# Altium schematic sheet 100046138_output_control.SchDoc
size 863 x 558 mm; SheetNumber: 3; SheetTotal: 4
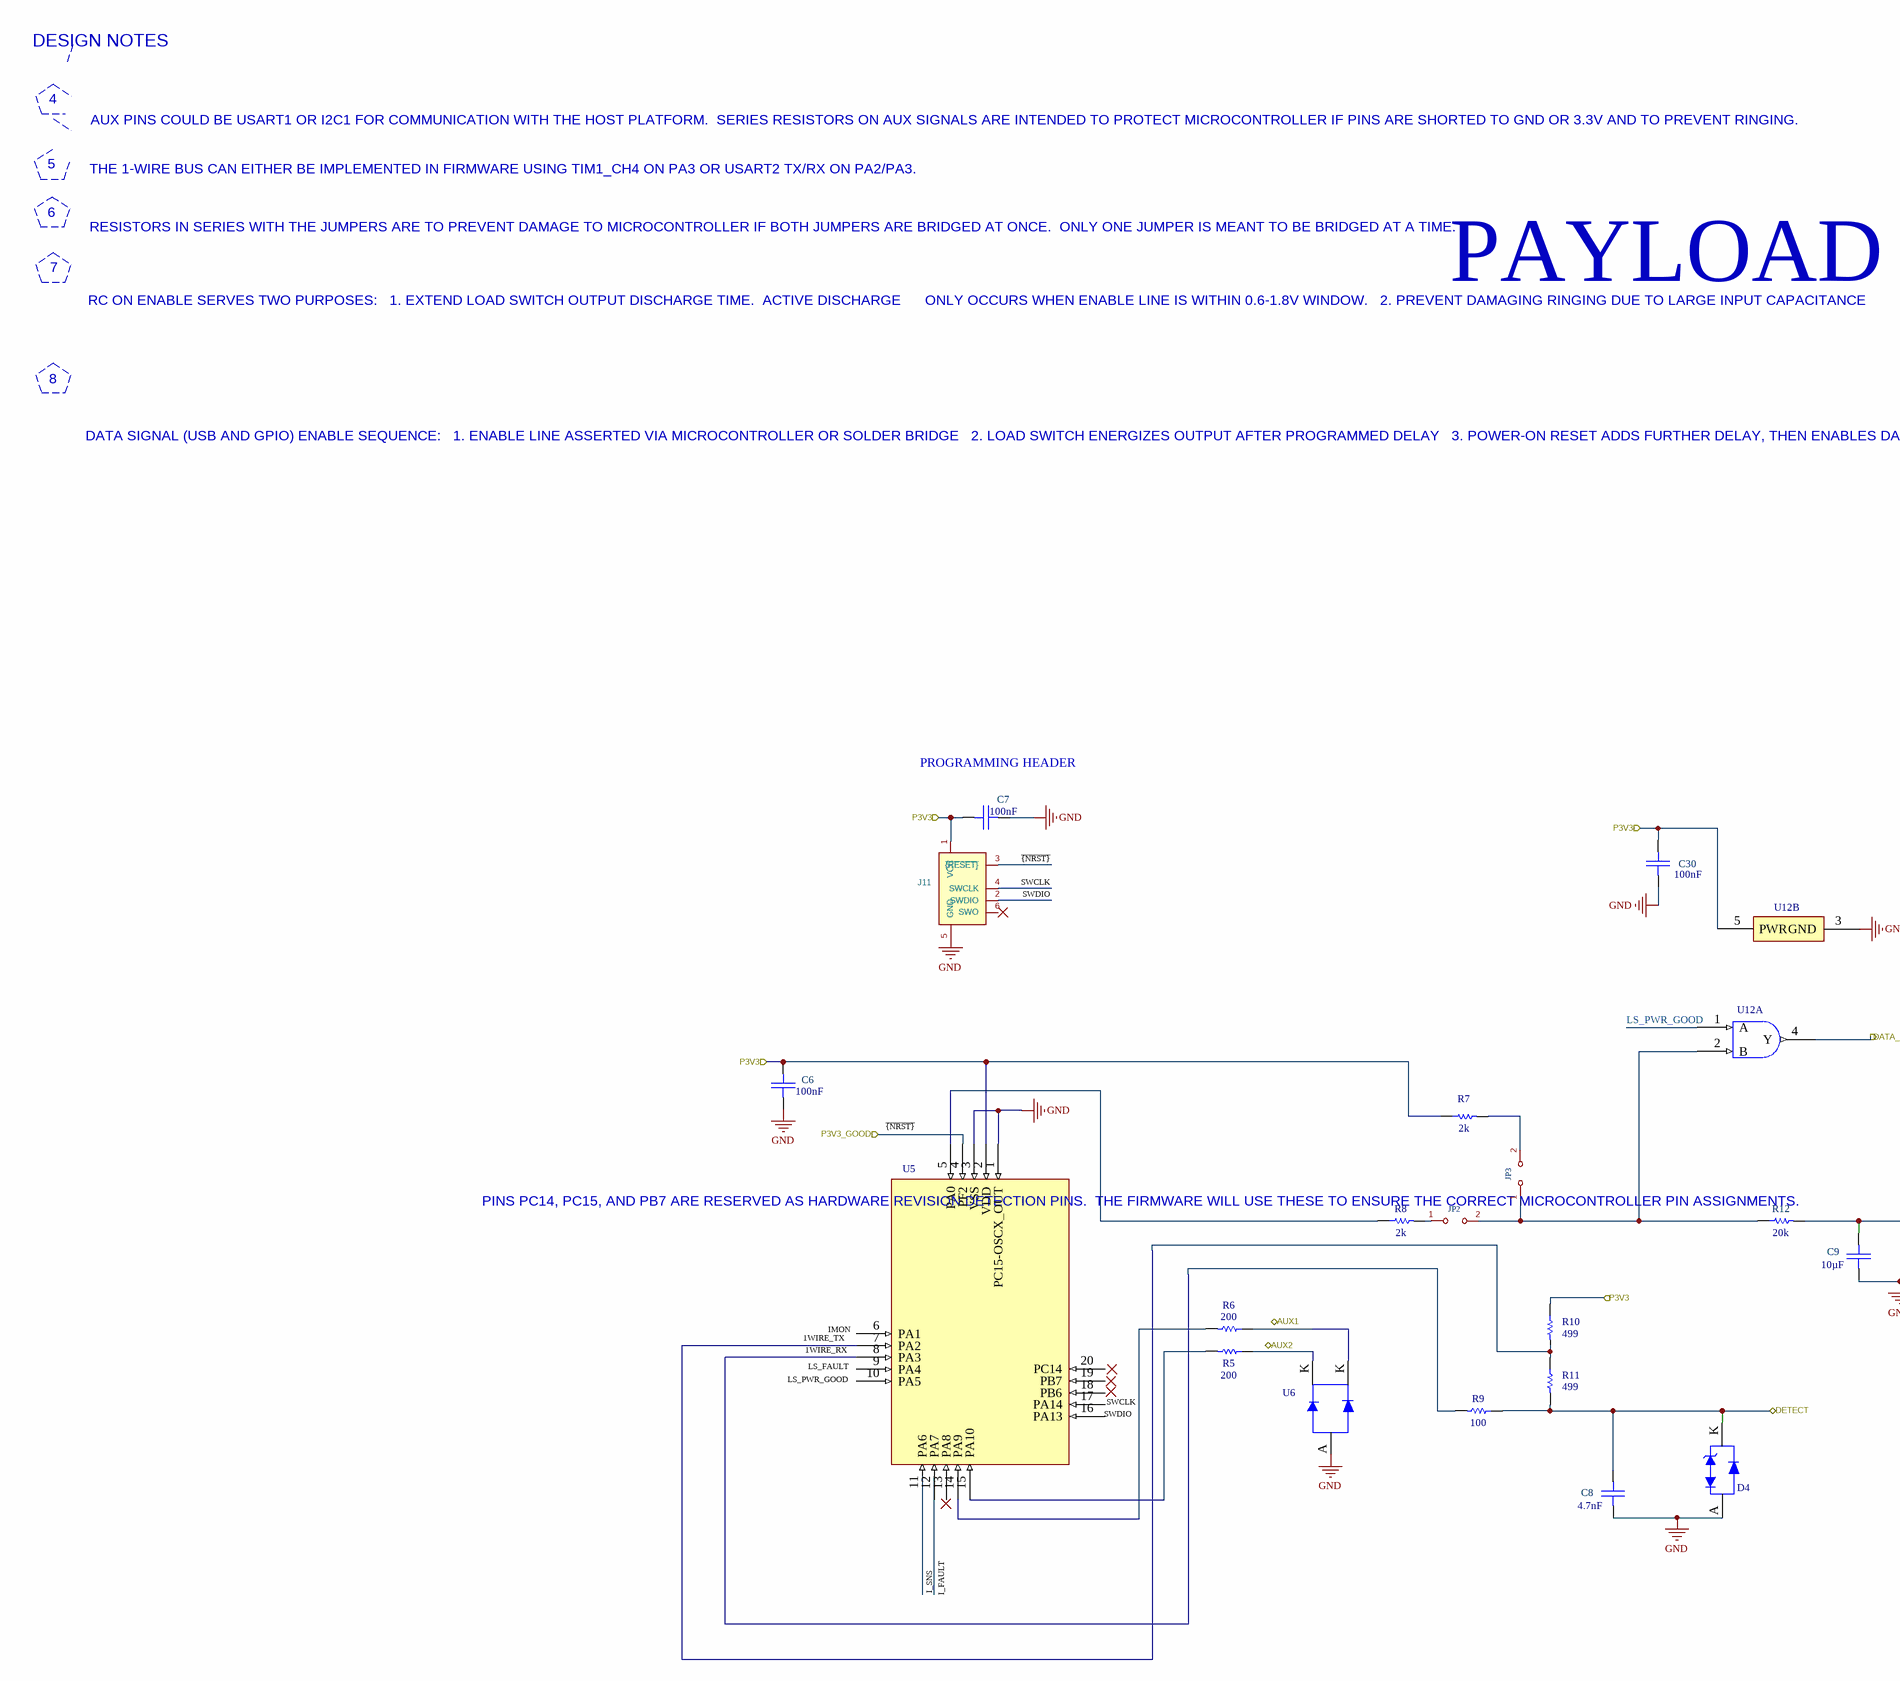
[diagram p0: 100046138_output_control.SchDoc, left]
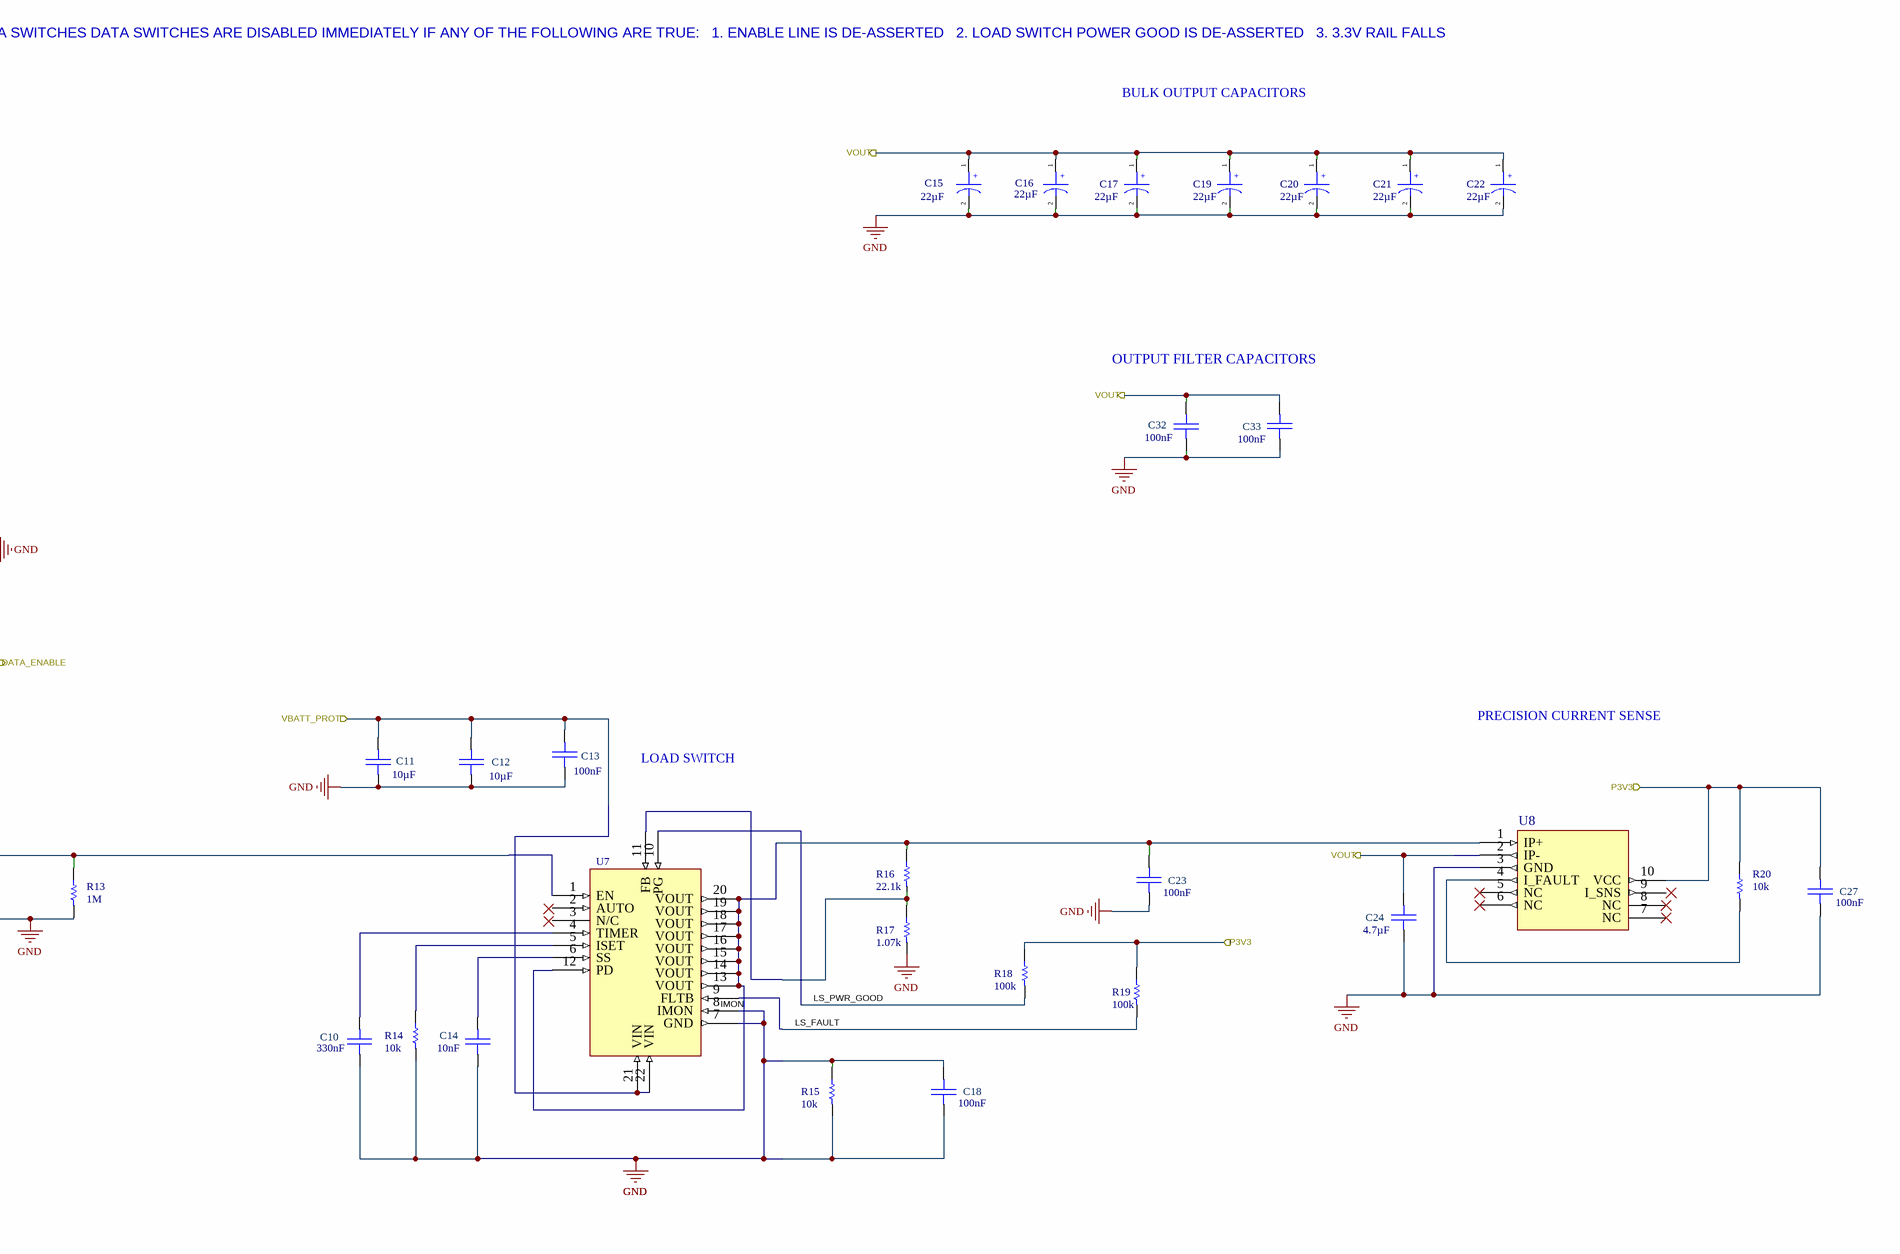
[diagram p1: 100046138_output_control.SchDoc, right]

## Parts
C6  value 100nF  [CAP-0402-A]  (hidden comment: Cap 0402 100nF 10% X7R)
C7  value 100nF  [CAP-0402-A]  (hidden comment: Cap 0402 100nF 10% X7R)
C8  value 4.7nF  [CAP-0402-A]  (hidden comment: CAP 0402 4700PF 50V 10% X7R)
C9  value 10µF  [CAP-0402-A]  (hidden comment: Cap 0402 10uF 10V 20% X5R)
C10  value 330nF  [CAP-0402-A]  (hidden comment: Cap 0402 0.33uF 16V 10% X7S)
C11  value 10µF  [CAP-0805-A]  (hidden comment: CAP 0805 10UF 50V 10% X5R)
C12  value 10µF  [CAP-0805-A]  (hidden comment: CAP 0805 10UF 50V 10% X5R)
C13  value 100nF  [CAP-0402-A]  (hidden comment: Cap 0402 100nF 10% X7R)
C14  value 10nF  [CAP-0402-A]  (hidden comment: Cap 0402 10000pf 50V 10% X7R)
C15  value 22µF  [CAP-0805-A]  (hidden comment: CAP 0805 22uF 35V 20% X5R)
C16  value 22µF  [CAP-0805-A]  (hidden comment: CAP 0805 22uF 35V 20% X5R)
C17  value 22µF  [CAP-0805-A]  (hidden comment: CAP 0805 22uF 35V 20% X5R)
C18  value 100nF  [CAP-0402-A]  (hidden comment: Cap 0402 100nF 10% X7R)
C19  value 22µF  [CAP-0805-A]  (hidden comment: CAP 0805 22uF 35V 20% X5R)
C20  value 22µF  [CAP-0805-A]  (hidden comment: CAP 0805 22uF 35V 20% X5R)
C21  value 22µF  [CAP-0805-A]  (hidden comment: CAP 0805 22uF 35V 20% X5R)
C22  value 22µF  [CAP-0805-A]  (hidden comment: CAP 0805 22uF 35V 20% X5R)
C23  value 100nF  [CAP-0402-A]  (hidden comment: Cap 0402 100nF 10% X7R)
C24  value 4.7µF  [CAP-0805-A]  (hidden comment: CAP 0805 4.7UF 50V 10% X7R)
C27  value 100nF  [CAP-0402-A]  (hidden comment: Cap 0402 100nF 10% X7R)
C30  value 100nF  [CAP-0402-A]  (hidden comment: Cap 0402 100nF 10% X7R)
C32  value 100nF  [CAP-0402-A]  (hidden comment: Cap 0402 100nF 10% X7R)
C33  value 100nF  [CAP-0402-A]  (hidden comment: Cap 0402 100nF 10% X7R)
D4  SMF3.3  [DI-SOD123F-A]  (value not drawn)
J11  Conn_ARM_SWD_TagConnect_TC2030-NL  [Tag-Connect_TC2030-IDC-NL_2x03_P1.27mm_Vertical]  (value not drawn)
JP2  Jumper_2_Bridged  [SolderJumper-2_P1.3mm_Open_TrianglePad1.0x1.5mm]  (value not drawn)
JP3  Jumper_2_Open  [SolderJumper-2_P1.3mm_Open_TrianglePad1.0x1.5mm]  (value not drawn)
R5  value 200  [RES-0402-A]  (hidden comment: RES 0402 200 OHM 1/10W 1%)
R6  value 200  [RES-0402-A]  (hidden comment: RES 0402 200 OHM 1/10W 1%)
R7  value 2k  [RES-0402-B]  (hidden comment: Res 0402 2K Ohm 1/10W 1% Thick Flim)
R8  value 2k  [RES-0402-B]  (hidden comment: Res 0402 2K Ohm 1/10W 1% Thick Flim)
R9  value 100  [RES-0402-B]  (hidden comment: Res 0402 100 Ohm 0.1W 1% Thick Film)
R10  value 499  [RES-0402-A]  (hidden comment: RES 0402 499 OHM 1/10W 1%)
R11  value 499  [RES-0402-A]  (hidden comment: RES 0402 499 OHM 1/10W 1%)
R12  value 20k  [RES-0402-A]  (hidden comment: Res 0402 20k 1/16W 1% Thick Film)
R13  value 1M  [RES-0402-C]  (hidden comment: Res 0402 1.00M 0.1W 1% Thick Film)
R14  value 10k  [RES-0402-A]  (hidden comment: RES 0402 10K 1/10W 1%)
R15  value 10k  [RES-0402-A]  (hidden comment: RES 0402 10K 1/10W 1%)
R16  value 22.1k  [RES-0402-A]  (hidden comment: RES 0402 22.1K 1/10W 1%)
R17  value 1.07k  [RES-0402-A]  (hidden comment: RES 0402 1.07K 1/10W 1%)
R18  value 100k  [RES-0402-C]  (hidden comment: Res 0402 100K 1/10W 1% Thick Flim)
R19  value 100k  [RES-0402-C]  (hidden comment: Res 0402 100K 1/10W 1% Thick Flim)
R20  value 10k  [RES-0402-A]  (hidden comment: RES 0402 10K 1/10W 1%)
U5  STM32C011F6U6TR  [IC-UFQFPN20-A]  (value not drawn)
U6  PESD5V0C2UM  [IC-SOT883-2-B]  (value not drawn)
U7  MPQ5069GQV-AEC1-Z  [IC-QFN22-3X5-A]  (value not drawn)
U8  ACS711KEXLT-15AB-T  [QFN127P600-8N]  (value not drawn)
U12  Gate - AND  [IC-SOT553-A]  (value not drawn)  (parts A,B of 2)

## Ports
AUX1 (bidir), AUX2 (bidir), DATA_ENABLE (out), DETECT (bidir), P3V3 (in), P3V3_GOOD (in), VBATT_PROT (in), VOUT (out)

## Nets
GND: C6.1 C7.2 C8.1 C9.1 C10.1 C11.1 C12.1 C13.1 C14.1 C15.2 C16.2 C17.2 C18.1 C18.2 C19.2 C20.2 C21.2 C22.2 C23.1 C24.1 C27.2 C30.1 C32.2 C33.1 D4.A J11.5(GND) R13.1 R14.1 R15.1 R15.2 R17.1 U5.1(PC15-OSCX_OUT) U5.3(VSS) U7.7(GND) U7.8(IMON) U8.3(GND) U12.3(GND)
DATA_ENABLE: U12.4(Y) ; port DATA_ENABLE
DETECT: C8.2 D4.K R9.2 R11.1 ; port DETECT
LS_FAULT: R19.1 U7.9(FLTB)
LS_PWR_GOOD: R18.1 U7.10(PG) U12.1(A)
P3V3: C6.2 C7.1 C27.1 C30.2 J11.1(VCC) R7.2 R10.2 R18.2 R19.2 R20.2 U5.2(VDD) U8.10(VCC) U12.5(PWR) ; port P3V3
P3V3_GOOD: U5.4(PF2) ; port P3V3_GOOD
SWCLK: J11.4(SWCLK)
SWDIO: J11.2(SWDIO)
VBATT_PROT: C11.2 C12.2 C13.2 U7.21(VIN) U7.22(VIN) ; port VBATT_PROT
VOUT: C15.1 C16.1 C17.1 C19.1 C20.1 C21.1 C22.1 C24.2 C32.1 C33.2 U8.2(IP-) ; port VOUT
~{{NRST}}: J11.3(~{{RESET}})
NetC9_2: C9.2 R12.1 R13.2 U7.1(EN)
NetC10_2: C10.2 U7.4(TIMER)
NetC14_2: C14.2 U7.6(SS)
NetC23_2: C23.2 R16.2 U7.12(PD) U7.13(VOUT) U7.14(VOUT) U7.15(VOUT) U7.16(VOUT) U7.17(VOUT) U7.18(VOUT) U7.19(VOUT) U7.20(VOUT) U8.1(IP+)
NetJP2_1: JP2.1(A) R8.1
NetJP2_2: JP2.2(B) JP3.1(A) R12.2 U12.2(B)
NetJP3_2: JP3.2(B) R7.1
NetR5_1: R5.1 U5.15(PA10)
NetR5_2: R5.2 U6.K
NetR6_1: R6.1 U5.14(PA9)
NetR6_2: R6.2 U6.K
NetR8_2: R8.2 U5.5(PA0)
NetR9_1: R9.1 U5.8(PA3)
NetR10_1: R10.1 R11.2 U5.7(PA2)
NetR14_2: R14.2 U7.5(ISET)
NetR16_1: R16.1 R17.2 U7.11(FB)
NetR20_1: R20.1 U8.4(I_FAULT)

Not connected (* = marked no-connect by the designer): J11 6(SWO); U5 6(PA1) 9(PA4) 10(PA5) 11(PA6) 12(PA7) 13(PA8) 16(PA13) 17(PA14) 18(PB6) 19(PB7) 20(PC14); U6 A; U7 2(AUTO) 3(N/C); U8 5(NC)* 6(NC)* 7(NC)* 8(NC)* 9(I_SNS)

## Notes on the sheet
- DESIGN NOTES
- 4
- AUX PINS COULD BE USART1 OR I2C1 FOR COMMUNICATION
  WITH THE HOST PLATFORM.  SERIES RESISTORS ON AUX SIGNALS
  ARE INTENDED TO PROTECT MICROCONTROLLER IF PINS ARE
  SHORTED TO GND OR 3.3V AND TO PREVENT RINGING.
- 5
- THE 1-WIRE BUS CAN EITHER BE IMPLEMENTED IN FIRMWARE
  USING TIM1_CH4 ON PA3 OR USART2 TX/RX ON PA2/PA3.
- 6
- 7
- RESISTORS IN SERIES WITH THE JUMPERS ARE TO PREVENT
  DAMAGE TO MICROCONTROLLER IF BOTH JUMPERS ARE BRIDGED
  AT ONCE.  ONLY ONE JUMPER IS MEANT TO BE BRIDGED AT A TIME.
- RC ON ENABLE SERVES TWO PURPOSES:
  1. EXTEND LOAD SWITCH OUTPUT DISCHARGE TIME.  ACTIVE DISCHARGE
  ONLY OCCURS WHEN ENABLE LINE IS WITHIN 0.6-1.8V WINDOW.
  2. PREVENT DAMAGING RINGING DUE TO LARGE INPUT CAPACITANCE
- PAYLOAD POWER CONTROL
- 8
- DATA SIGNAL (USB AND GPIO) ENABLE SEQUENCE:
  1. ENABLE LINE ASSERTED VIA MICROCONTROLLER OR SOLDER BRIDGE
  2. LOAD SWITCH ENERGIZES OUTPUT AFTER PROGRAMMED DELAY
  3. POWER-ON RESET ADDS FURTHER DELAY, THEN ENABLES DATA SWITCHES
  DATA SWITCHES ARE DISABLED IMMEDIATELY IF ANY OF THE FOLLOWING ARE TRUE:
  1. ENABLE LINE IS DE-ASSERTED
  2. LOAD SWITCH POWER GOOD IS DE-ASSERTED
  3. 3.3V RAIL FALLS BELOW POWER-ON RESET THRESHOLD
- BULK OUTPUT CAPACITORS
- (near C7) PROGRAMMING HEADER
- OUTPUT FILTER CAPACITORS
- PRECISION CURRENT SENSE
- LOAD SWITCH
- (near U5) PINS PC14, PC15, AND PB7 ARE
  RESERVED AS HARDWARE REVISION
  DETECTION PINS.  THE FIRMWARE
  WILL USE THESE TO ENSURE THE
  CORRECT MICROCONTROLLER PIN
  ASSIGNMENTS.
- Labels drawn without touching a wire or pin: 1WIRE_RX, 1WIRE_TX, GND, I_FAULT, I_SNS, IMON, LS_FAULT, LS_PWR_GOOD, SWCLK, SWDIO, ~{{NRST}}
- DWG NO
- REVISIONS
- SH
- REVISION
- DESCRIPTION
- DATE(YEAR-MO-DA)
- APPROVED
- PART NO.
- DESIGN ACTIVITY
- US ARMY
  COMBAT CAPABILITIES DEVELOPMENT COMMAND ARMAMENTS CENTER
  PICATINNY ARSENAL, NEW JERSEY 07806-5000
- SIZE
- CAGE CODE
- DWG NO.
- D
- 19200
- SCALE
- NONE
- UNIT WT.
- ---
- SHEET
- (in symbol CAP-00375-1) +

## Library data of the parts
C6 C7 C13 C18 C23 C27 C30 C32 C33 = CAP-00363-2: Leader Qty: 100; UOM: EA; Voltage Rating: 50V; Footprint: Capacitor_SMD:C_0402_1005Metric; Case/Package: 0402; Max Operating Temperature: 125°C; Min Operating Temperature: -55°C; Mounting Technology: Surface Mount; Tolerance: 10%
C8 = CAP-00371-1: Leader Qty: 100; UOM: EA; Footprint: Capacitor_SMD:C_0402_1005Metric; Case/Package: 0402; Max Operating Temperature: 150°C; Min Operating Temperature: -55°C; Mounting Technology: Surface Mount; Tolerance: 10%
C9 = CAP-00021-6: Capacitor Type: Ceramic; Leader Qty: 100; Footprint: Capacitor_SMD:C_0402_1005Metric; Case/Package: 0402; Max Operating Temperature: 85°C; Min Operating Temperature: -55°C; Mounting Technology: SMT; Pins: 2; RoHS Compliant: Yes; Tolerance: 20%; Voltage Rating: 10V
C10 = CAP-00366-2: Leader Qty: 100; UOM: EA; Footprint: Capacitor_SMD:C_0402_1005Metric; Case/Package: 0402; Max Operating Temperature: 125°C; Min Operating Temperature: -55°C; Mounting Technology: Surface Mount; Voltage Rating: 16V
C11 C12 = CAP-00370-1: Leader Qty: 100; UOM: EA; Footprint: Capacitor_SMD:C_0805_2012Metric; Case/Package: 0805; Dielectric: X5R; Max Operating Temperature: 85°C; Min Operating Temperature: -55°C; Mounting Technology: Surface Mount
C14 = CAP-00186-4: 0402 10 nF 50 V ±10 % Tolerance X7R SMT Multilayer Ceramic Capacitor; Leader Qty: 100; Footprint: Capacitor_SMD:C_0402_1005Metric; Case/Package: 0402; Case Code (Imperial): 0402; Max Operating Temperature: 125°C; Min Operating Temperature: -55°C; Mounting Technology: Surface Mount; RoHS Compliant: Yes; Tolerance: 10%; Voltage Rating: 50V
C15-C17 C19-C22 = CAP-00375-1: Leader Qty: 25; Footprint: Capacitor_SMD:C_0805_2012Metric; Case/Package: 0805; Max Operating Temperature: 85°C; Min Operating Temperature: -55°C; Mounting Technology: Surface Mount; Tolerance: 20%; Voltage Rating: 35V
C24 = CAP-00372-1: Leader Qty: 100; UOM: EA; Footprint: Capacitor_SMD:C_0805_2012Metric; Case/Package: 0805; Max Operating Temperature: 125°C; Min Operating Temperature: -55°C; Mounting Technology: Surface Mount; Voltage Rating: 50V
D4 = CMP-00658-1: ESD protection diodes / TVS diodes; LITTELFUSE; SMF3.3; 6.8 V; 30 A; 3.3 V; 3.4 V - 4.3 V; Breakdown Voltage: 3.85V; Clamping Voltage: 6.8V; Direction: Unidirectional; Forward Voltage: 16V; Max Breakdown Voltage: 4.3V; Max Junction Temperature (Tj): 150°C; Max Power Dissipation: 1.7W; Max Reverse Leakage Current: 500nA; Min Breakdown Voltage: 3.4V; Number of Channels: 1; Peak Pulse Current: 30A; Peak Pulse Power: 200W; Reverse Standoff Voltage: 3.3V; Test Current: 10mA; Footprint: 1a_Littelfuse:SOD-123FL; Country of Origin: Mainland China; Export Control Classification Number (ECCN) Code: EAR99; Harmonized Tariff Schedule (HTS) Code: 8541.10.00.50; Height: 1.08mm; Introduction Date: 2016-08-01; Lifecycle Status: Production; Max Operating Temperature: 150°C; Min Operating Temperature: -55°C; Number of Elements: 1; Number of Terminals: 2; Packaging: Cut Tape; Peak Reverse Current: 500nA; Polarity: Unidirectional; REACH SVHC: No; Reverse Voltage: 3.3V; RoHS: Compliant; Schedule B: 8541100080
J11 = Conn_ARM_SWD_TagConnect_TC2030-NL: Manufacturer: Tag-Connect LLC; MPN: TC2030-CTX; Value: Conn_ARM_SWD_TagConnect_TC2030-NL; Footprint: Connector:Tag-Connect_TC2030-IDC-NL_2x03_P1.27mm_Vertical
R5 R6 = RES-00801-1: Leader Qty: 100; UOM: EA; Voltage Rating: 50V; Footprint: Resistor_SMD:R_0402_1005Metric; Case/Package: 0402; Max Operating Temperature: 155°C; Min Operating Temperature: -55°C; Mounting Technology: Surface Mount; Tolerance: 1%
R7 R8 = RES-00296-6: Leader Qty: 100; Power: 100mW; Voltage Rating: 50V; Footprint: Resistor_SMD:R_0402_1005Metric; Case/Package: 0402; Max Operating Temperature: 155°C; Min Operating Temperature: -55°C; Mounting Technology: SMT; Pins: 2; RoHS Compliant: Yes; Tolerance: 1%
R9 = RES-00021-9: Power: 100mW; Voltage Rating: 100V; Footprint: Resistor_SMD:R_0402_1005Metric; Case/Package: 0402; Leader Qty: 100; Max Operating Temperature: 155°C; Min Operating Temperature: -55°C; Mounting Technology: SMD; Pins: 2; Tolerance: 1%
R10 R11 = RES-00802-1: Leader Qty: 100; UOM: EA; Voltage Rating: 50V; Footprint: Resistor_SMD:R_0402_1005Metric; Case/Package: 0402; Max Operating Temperature: 155°C; Min Operating Temperature: -55°C; Mounting Technology: Surface Mount; Tolerance: 1%
R12 = RES-00405-6: Leader Qty: 100; Max Power Dissipation: 63mW; Power Rating: 62.5mW; Temperature Coefficient: 100ppm/°C; UOM: EA; Voltage Rating (DC): 50V; Footprint: Resistor_SMD:R_0402_1005Metric; Case/Package: 0402; Case Code (Imperial): 0402; Features: Moisture Resistant; Max Operating Temperature: 155°C; Min Operating Temperature: -55°C; Pins: 2; Resistance Tolerance: 1%; Resistor Type: Thick Film; RoHS Compliant: Yes; Series: RC; Tolerance: 1%; Voltage Rating: 50V
R13 = RES-00025-9: Leader Qty: 100; Power: 100mW; Voltage Rating: 100V; Footprint: Resistor_SMD:R_0402_1005Metric; Case/Package: 0402; Max Operating Temperature: 155°C; Min Operating Temperature: -55°C; Mounting Technology: SMD; Pins: 2; RoHS Compliant: Yes; Tolerance: 1%
R14 R15 R20 = RES-00803-1: Leader Qty: 100; UOM: EA; Voltage Rating: 75V; Footprint: Resistor_SMD:R_0402_1005Metric; Case/Package: 0402; Max Operating Temperature: 155°C; Min Operating Temperature: -55°C; Mounting Technology: Surface Mount; Tolerance: 1%
R16 = RES-00804-1: Leader Qty: 100; UOM: EA; Voltage Rating: 50V; Footprint: Resistor_SMD:R_0402_1005Metric; Case/Package: 0402; Max Operating Temperature: 155°C; Min Operating Temperature: -55°C; Mounting Technology: Surface Mount; Tolerance: 1%
R17 = RES-00805-1: Leader Qty: 100; UOM: EA; Voltage Rating: 50V; Footprint: Resistor_SMD:R_0402_1005Metric; Case/Package: 0402; Max Operating Temperature: 155°C; Min Operating Temperature: -55°C; Mounting Technology: Surface Mount; Tolerance: 1%
R18 R19 = RES-00031-9: Leader Qty: 100; Footprint: Resistor_SMD:R_0402_1005Metric; Case/Package: 0402; Max Operating Temperature: 155°C; Min Operating Temperature: -55°C; Mounting Technology: SMT; Pins: 2; RoHS Compliant: Yes; Tolerance: 1%
U5 = IC-00427-2: RISC Microcontroller, 32-Bit, FLASH, CORTEX-M4F CPU, 180MHz, CMOS, PBGA216; ADC Channels (Resolution): 13-Ch 12-Bit; Clock Frequency: 48MHz; EEPROM Memory Size: 0B; Interface: I2C, I2S, SPI; Max Supply Current: 4.1mA; Max Supply Voltage: 3.6V; Min Supply Voltage: 3V; Number of I/Os: 2; Number of Interrupts: 18; Number of Timers/Counters: 9; Peripherals: POR, PWM; RAM Size: 6kB; China RoHS: Compliant; Country of Origin: Mainland China, Philippines, Taiwan; Export Control Classification Number (ECCN) Code: 3A991.A.2; Harmonized Tariff Schedule (HTS) Code: 8542.31.00.25; Height - Seated (Max): 600µm; Introduction Date: 2023-01-06; Length: 3mm; Lifecycle Status: Production; Max Operating Temperature: 85°C; Memory Format: FLASH; Min Operating Temperature: -40°C; Number of Terminals: 20; Operating Supply Voltage: 3V; REACH SVHC: Yes; RoHS: Compliant; Terminal Pitch: 500µm; Width: 3mm
U6 = CMP-00652-2: Extremely low capacitance unidirectional ESD protection diode array; Manufacturer Lifecycle Status: RELEASED FOR SUPPLY; Lifecycle Status: Production
U7 = CMP-00666-1: 7mΩ Protection Switch with Current Monitor for Automotive Battery Systems AEC-Q100 Qualified; Manufacturer Lifecycle Status: ACTIVE; Max Supply Voltage: 28V; Min Supply Voltage: 6V; Number of Channels: 1; Operating Supply Voltage: 12V; Footprint: 1a_Misc:QFN-22_3_x_5mm; Country of Origin: Mainland China; Export Control Classification Number (ECCN) Code: EAR99; Harmonized Tariff Schedule (HTS) Code: 8542.39.00.60; Height - Seated (Max): 1mm; Introduction Date: 2020-12-14; Length: 5mm; Lifecycle Status: Production; Max Operating Temperature: 125°C; Min Operating Temperature: -40°C; Number of Circuits: 1; Number of Terminals: 22; REACH SVHC: Yes; RoHS: Compliant; Width: 3mm
U8 = CMP-00662-1: Linear Current Sensor with Overcurrent Fault Output with <100 V Isolation, QFN-12, RoHS; -3db Bandwidth: 100kHz; Accuracy: 5%; Current Sensing: 15.5A; Isolation Voltage: 100V; Linearity: 1%; Max Supply Current: 5.5mA; Max Supply Voltage: 5.5V; Min Supply Voltage: 3V; Nominal Supply Voltage (DC): 3.3V; Number of Channels: 1; Polarity: Bidirectional; Response Time: 4.6µs; Sensitivity (mV/A): 90mV/A; Footprint: Sensor_Current:Allegro_QFN-12-10-1EP_3x3mm_P0.5mm; Bandwidth: 100kHz; Case/Package: WFQFN; China RoHS: Non-Compliant; Frequency: 100kHz; Height: 750µm; Introduction Date: 2011-03-25; Length: 3mm; Lifecycle Status: Production; Max Operating Temperature: 125°C; Min Operating Temperature: -40°C; Mounting Technology: Surface Mount; Number of Terminals: 12; Packaging: Tape and Reel; Pins: 12; REACH SVHC: Yes; RoHS: Compliant; Schedule B: 8542390000, 8542390000
U12 = IC-00426-1: 1-ch, 2-input 1.65-V to 5.5-V 32 mA drive strength AND gate 5-SOT-5X3 -40 to 125; Manufacturer Lifecycle Status: ACTIVE; High Level Output Current: -32mA; Low Level Output Current: 32mA; Max Junction Temperature (Tj): 150°C; Max Supply Voltage: 5.5V; Min Supply Voltage: 1.65V; Nominal Supply Current: 10µA; Number of Bits: 1; Number of Input Lines: 2; Output Current: 50mA; Propagation Delay: 3.4ns; Schmitt Trigger Input: No; Turn-On Delay Time: 4.5ns; Footprint: 1a_Misc:SOT-553 Texas Instruments DRL; Ambient Temperature Range High: 125°C; Case/Package: SOT-553; Contact Plating: Gold; Height: 0m; Lead Free: Lead Free; Length: 1.6mm; Lifecycle Status: Production; Logic Function: AND; Max Operating Temperature: 125°C; Min Operating Temperature: -40°C; Mounting Technology: Surface Mount; Number of Channels: 1; Number of Circuits: 1; Number of Elements: 1; Number of Gates: 1; Number of Inputs: 2; Number of Output Lines: 1; Number of Outputs: 1; Packaging: Cut Tape; Pins: 5; Quiescent Current: 10µA; Radiation Hardening: No; REACH SVHC: No; RoHS: Compliant; Schedule B: 8542390000, 8542390000; Thickness: 550µm; Weight: 2.806603mg; Width: 1.2mm
JP2 = Jumper_2_Bridged: Value: Jumper_2_Bridged; Footprint: Jumper:SolderJumper-2_P1.3mm_Open_TrianglePad1.0x1.5mm
JP3 = Jumper_2_Open: Value: Jumper_2_Open; Footprint: Jumper:SolderJumper-2_P1.3mm_Open_TrianglePad1.0x1.5mm